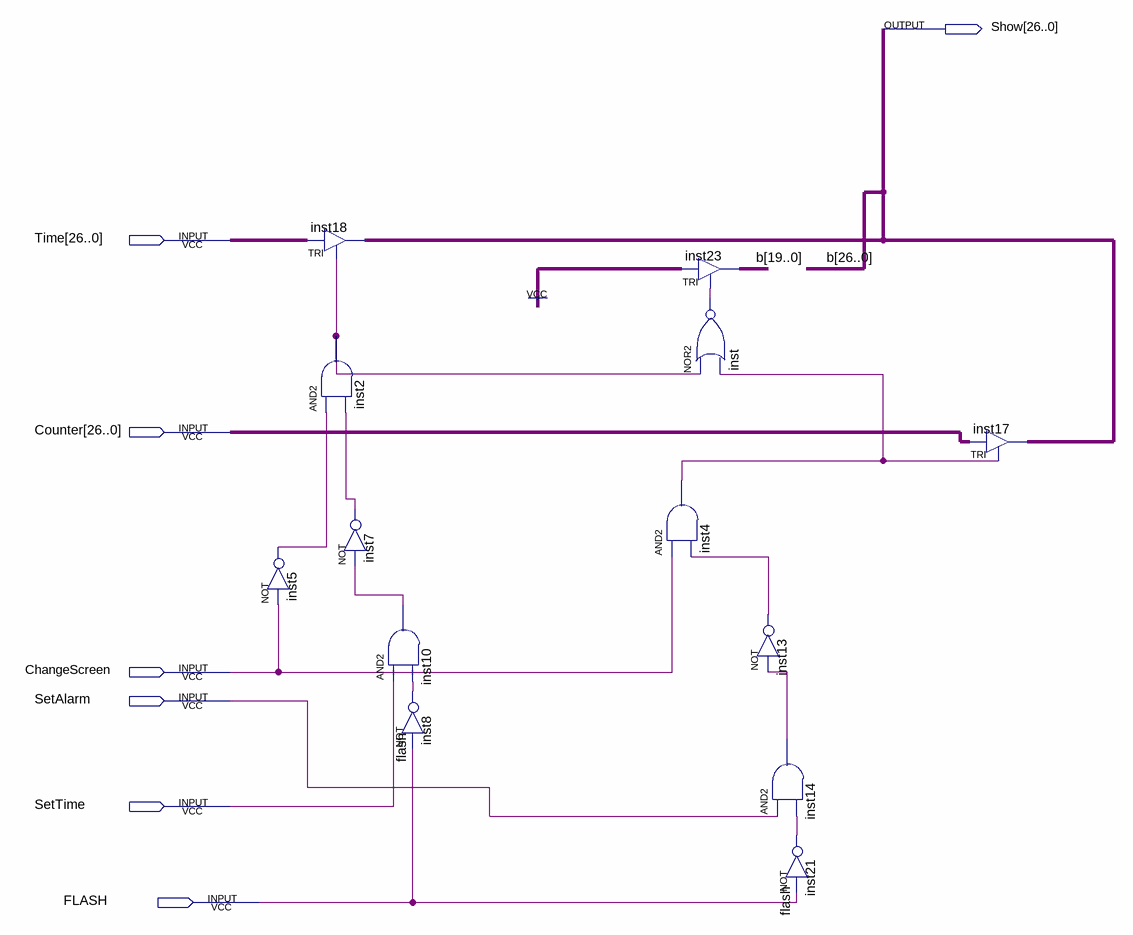
[diagram p0: schematic sheet]
// Quartus schematic SHOWCONTROLER.bdf as structural Verilog: 13 symbols, 7 pins
module SHOWCONTROLER (
  input  [26:0] Time,
  input  [26:0] Counter,
  input  ChangeScreen,
  input  SetAlarm,
  input  SetTime,
  input  FLASH,
  output [26:0] Show
);

  wire inst2_out, inst4_out, inst5_out, inst7_out, inst8_out, inst10_out, inst13_out, inst14_out, inst21_out,
       inst_out;

  not inst5 (inst5_out, ChangeScreen);
  TRI inst18[26:0] (.IN(Time), .OE(inst2_out), .OUT(Show));
  and inst2 (inst2_out, inst5_out, inst7_out);
  not inst7 (inst7_out, inst10_out);
  and inst10 (inst10_out, SetTime, inst8_out);
  not inst8 (inst8_out, FLASH);
  and inst4 (inst4_out, ChangeScreen, inst13_out);
  TRI inst23[19:0] (.IN({20{1'b1}}), .OE(inst_out), .OUT(Show[19:0]));
  nor inst (inst_out, inst2_out, inst4_out);
  not inst13 (inst13_out, inst14_out);
  and inst14 (inst14_out, SetAlarm, inst21_out);
  not inst21 (inst21_out, FLASH);
  TRI inst17[26:0] (.IN(Counter), .OE(inst4_out), .OUT(Show));

  // Other names for the same wires on the sheet: b[26:0] = Show
endmodule
